# Altium schematic sheet MCU_PART2.SchDoc: WearTech-MCU-P2
size A4; Revision: 1; SheetNumber: 3; SheetTotal: 3; ProjectName: WearTech
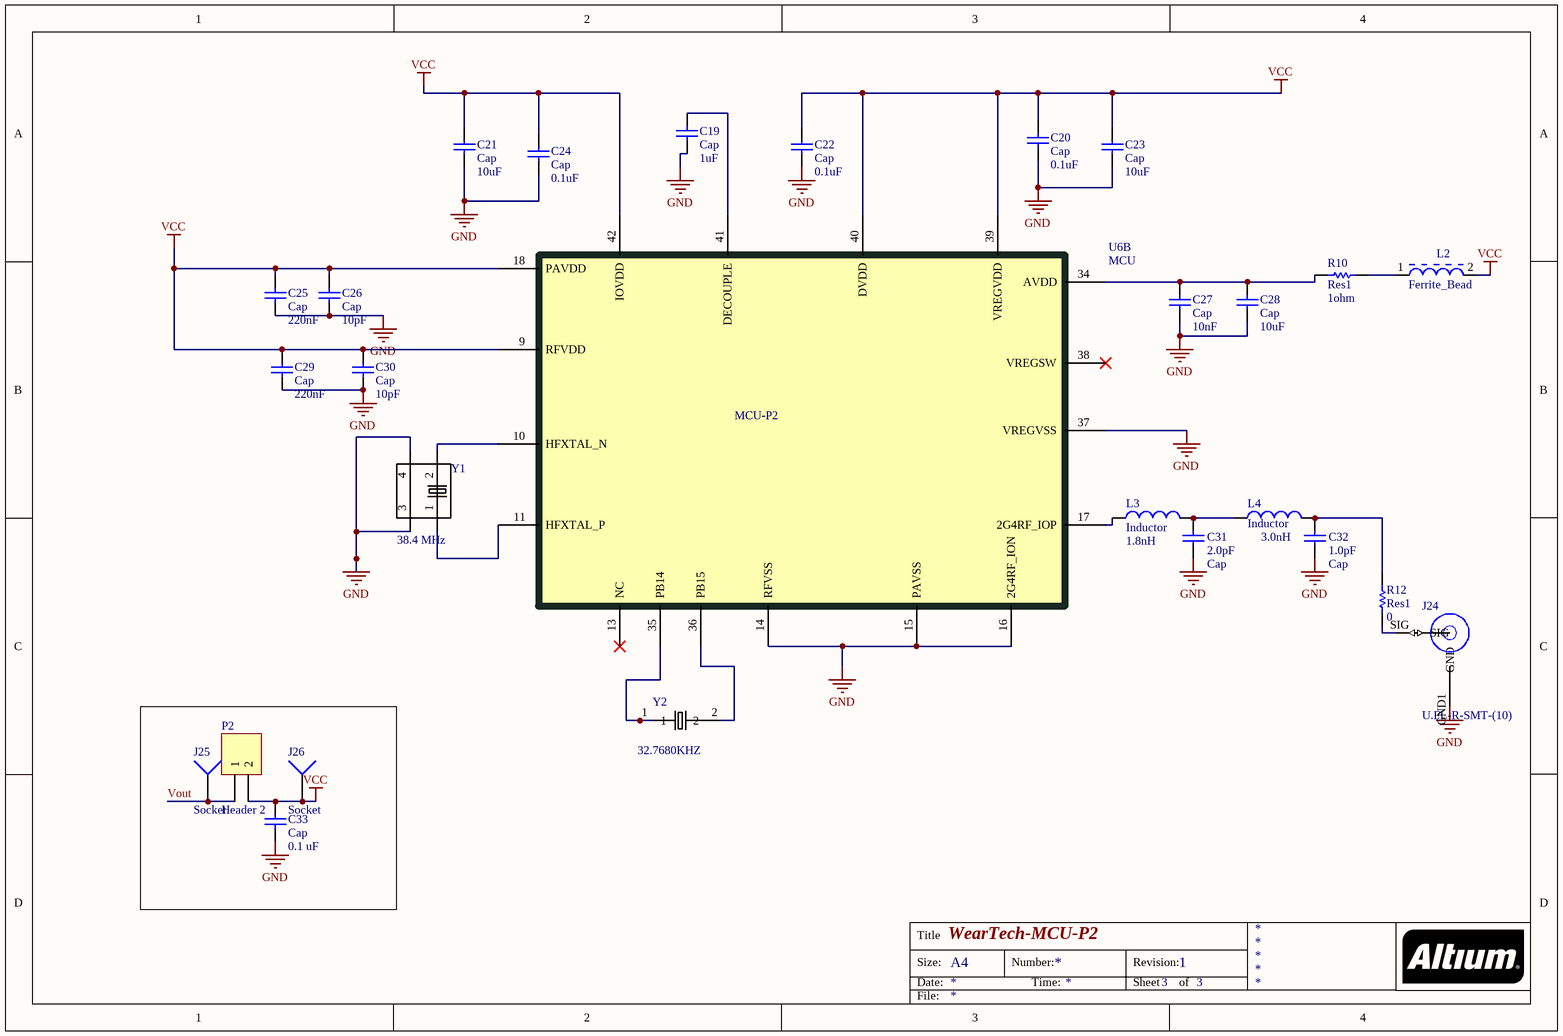
[diagram p0: MCU_PART2.SchDoc]

## Parts
C19  Cap  value 1uF  [1608[0603]]
C20  Cap  value 0.1uF  [1608[0603]]
C21  Cap  value 10uF  [1608[0603]]
C22  Cap  value 0.1uF  [1608[0603]]
C23  Cap  value 10uF  [1608[0603]]
C24  Cap  value 0.1uF  [1608[0603]]
C25  Cap  value 220nF  [1608[0603]]
C26  Cap  value 10pF  [1608[0603]]
C27  Cap  value 10nF  [1608[0603]]
C28  Cap  value 10uF  [1608[0603]]
C29  Cap  value 220nF  [1608[0603]]
C30  Cap  value 10pF  [1608[0603]]
C31  Cap  value 2.0pF  [1608[0603]]
C32  Cap  value 1.0pF  [1608[0603]]
C33  Cap  value 0.1 uF  [1608[0603]]
J24  U.FL-R-SMT-(10)
J25  Socket  [PIN1]
J26  Socket  [PIN1]
L2  Ferrite_Bead
L3  Inductor  value 1.8nH  [1608[0603]]
L4  Inductor  value 3.0nH  [1608[0603]]
P2  Header 2  [HDR1X2]
R10  Res1  value 1ohm  [1608[0603]]
R12  Res1  value 0  [1608[0603]]
U6  MCU  [QFN50P700X700X90_HS-49N]  (part B of 2)
Y1  value 38.4 MHz  (hidden comment: X1)
Y2  value 32.7680KHZ  [X2]  (hidden comment: X2)

## Nets
GND: C19.1 C20.1 C21.1 C22.1 C23.1 C24.1 C25.1 C26.1 C27.1 C28.1 C29.1 C30.1 C31.1 C32.1 C33.1 J24.GND1(GND) U6.14(RFVSS) U6.15(PAVSS) U6.16(2G4RF_ION) U6.37(VREGVSS) Y1.3 Y1.4
VCC: C20.2 C21.2 C22.2 C23.2 C24.2 C25.2 C26.2 C29.2 C30.2 C33.2 J26.1 L2.2 P2.2 U6.9(RFVDD) U6.18(PAVDD) U6.39(VREGVDD) U6.40(DVDD) U6.42(IOVDD)
Vout: J25.1 P2.1
NetC19_2: C19.2 U6.41(DECOUPLE)
NetC27_2: C27.2 C28.2 R10.1 U6.34(AVDD)
NetC31_2: C31.2 L3.2 L4.1
NetC32_2: C32.2 L4.2 R12.2
NetJ24_SIG: J24.SIG R12.1
NetL2_1: L2.1 R10.2
NetL3_1: L3.1 U6.17(2G4RF_IOP)
NetU6_10: U6.10(HFXTAL_N) Y1.2
NetU6_11: U6.11(HFXTAL_P) Y1.1
NetU6_35: U6.35(PB14) Y2.1
NetU6_36: U6.36(PB15) Y2.2

Not connected (* = marked no-connect by the designer): U6 13(NC)* 38(VREGSW)*

## Notes on the sheet
- (near U6) MCU-P2
- Title
- Size:
- Date:
- A4
- Number:
- Time:
- Revision:
- Sheet
- of
- File:

## Library data of the parts
C19 = Cap: CAP CER 1UF 25V X5R 0603; Manufacturer Part-Number: CL10A105KA5LNNC; ComponentLink1URL: http://www.samsungsem.com/kr/support/library/product-catalog/__icsFiles/afieldfile/2017/09/13/MLCC.pdf; Manufacturer: Manufacturer; ComponentLink1Description: Datasheet; Digikey Part Number: 1276-1858-1-ND
C20 C22 C24 C33 = Cap: CAP CER 0.1UF 16V X7R 0603; Manufacturer Part-Number: GRM188R71C104KA01D; Manufacturer: Murata Electronics North America; ComponentLink1URL: http://search.murata.co.jp/Ceramy/image/img/A01X/G101/ENG/GRM188R71C104KA01-01.pdf; ComponentLink1Description: Datasheet; Digikey Part Number: 490-1532-1-ND
C21 C23 C28 = Cap: CAP CER 22UF 4V X5R 0603; Manufacturer Part-Number: CL10A226MR8NQNC; Manufacturer: Samsung Electro-Mechanics; ComponentLink1URL: http://www.samsungsem.com/kr/support/product-search/mlcc/__icsFiles/afieldfile/2016/12/21/CL10A226MR8NQNC_161221_1.pdf; ComponentLink1Description: Datasheet; Digikey Part Number: 1276-1891-1-ND
C25 C29 = Cap: CAP CER 0.22UF 10V X5R 0603; Manufacturer Part-Number: GRM188R61A224KA01D; Manufacturer: Murata Electronics North America; ComponentLink1URL: http://search.murata.co.jp/Ceramy/image/img/A01X/G101/ENG/GRM188R61A224KA01-01.pdf; ComponentLink1Description: Datasheet; Digikey Part Number: 490-1537-1-ND
C26 C30 = Cap: CAP CER 10PF 50V C0G/NP0 0603; Manufacturer Part-Number: GRM1885C1H100JA01D; Manufacturer: Murata Electronics North America; ComponentLink1URL: http://search.murata.co.jp/Ceramy/image/img/A01X/G101/ENG/GRM1885C1H100JA01-01.pdf; ComponentLink1Description: Datasheet; Digikey Part Number: 490-1403-1-ND
C27 = Cap: CAP CER 10000PF 10V U2J 0603; Manufacturer Part-Number: GRM1857U1A103JA44D; Manufacturer: Murata Electronics North America; ComponentLink1URL: http://search.murata.co.jp/Ceramy/image/img/A01X/G101/ENG/GRM1857U1A103JA44-01.pdf; ComponentLink1Description: Datasheet; Digikey Part Number: 490-8269-1-ND
C31 = Cap: CAP CER 2PF 50V C0G/NP0 0603; Manufacturer Part-Number: CL10C020BB8NNNC; Manufacturer: Samsung Electro-Mechanics; ComponentLink1URL: http://www.samsungsem.com/kr/support/product-search/mlcc/__icsFiles/afieldfile/2016/08/18/S_CL10C020BB8NNNC.pdf; ComponentLink1Description: Datasheet; Digikey Part Number: 1276-1815-2-ND
C32 = Cap: CAP CER 1PF 50V C0G/NP0 0603; Manufacturer Part-Number: GRM1885C1H1R0WA01D; Manufacturer: Murata Electronics North America; ComponentLink1URL: http://search.murata.co.jp/Ceramy/image/img/A01X/G101/ENG/GRM1885C1H1R0WA01-01.pdf; ComponentLink1Description: Datasheet; Digikey Part Number: 490-16342-1-ND
J24 = U.FL-R-SMT-(10): CONN UMC RCPT STR 50 OHM SMD; Manufacturer Part-Number: 0734120110; Manufacturer: Molex, LLC; ComponentLink1URL: http://www.molex.com/pdm_docs/ps/PS-73598-021-001.pdf; ComponentLink1Description: Datasheet; Digikey Part Number: WM5587CT-ND
J25 J26 = Socket: Manufacturer Part-Number: 68000-200HLF; Manufacturer: Amphenol FCI; Description: BERGSTRIP .100" DR STRAIGHT; ComponentLink1URL: http://cdn.amphenol-icc.com/media/wysiwyg/files/drawing/68000.pdf; ComponentLink1Description: Datasheet; Digikey Part Number: 609-5099-1-ND
L2 = Ferrite_Bead: FERRITE BEAD 1 KOHM 0603 1LN; Manufacturer Part-Number: 74279266; Manufacturer: Wurth Electronics Inc.; ComponentLink1URL: http://katalog.we-online.de/pbs/datasheet/74279266.pdf; ComponentLink1Description: Datasheet; Digikey Part Number: 732-4484-1-ND
L3 = Inductor: FIXED IND 1.8NH 250MA 400 MOHM; Manufacturer Part-Number: LQP18MN1N8C02D; Manufacturer: Murata Electronics North America; ComponentLink1URL: http://search.murata.co.jp/Ceramy/image/img/P02/JELF243C-0009.pdf; ComponentLink1Description: Datasheet; Digikey Part Number: 490-11750-1-ND
L4 = Inductor: FIXED IND 3NH 670MA 170 MOHM SMD; Manufacturer Part-Number: LQW18AN3N0C80D; Manufacturer: Murata Electronics North America; ComponentLink1URL: http://search.murata.co.jp/Ceramy/image/img/P02/JELF243A-0102.pdf; ComponentLink1Description: Datasheet; Digikey Part Number: 490-11771-1-ND
P2 = Header 2: Header, 2-Pin; Manufacturer Part-Number: SPC02SYAN; Manufacturer: Sullins Connector Solutions; Description: CONN JUMPER SHORTING GOLD FLASH; ComponentLink1URL: http://www.sullinscorp.com/catalogs/282_PAGE124-125_.100_JUMPER.pdf; ComponentLink1Description: Datasheet; Digikey Part Number: S9001-ND
R10 = Res1: RES SMD 1 OHM 1% 1/10W 0603; Manufacturer Part-Number: RC0603FR-071RL; Manufacturer: Yageo; ComponentLink1URL: http://www.yageo.com/documents/recent/PYu-RC_Group_51_RoHS_L_8.pdf; ComponentLink1Description: Datasheet; Digikey Part Number: 311-1.00HRCT-ND
R12 = Res1: RES SMD 0 OHM JUMPER 1/10W 0603; Manufacturer Part-Number: RC0603JR-070RL; Manufacturer: Yageo; ComponentLink1URL: http://www.yageo.com/documents/recent/PYu-RC_Group_51_RoHS_L_8.pdf; ComponentLink1Description: Datasheet; Digikey Part Number: 311-0.0GRCT-ND
U6 = MCU: RF System on a Chip - SoC Blue Premium 19dBm 2.4G 512kB 64kB(RAM); Manufacturer Part-Number: EFR32BG13P732F512GM48-C; Manufacturer: Silicon Labs; ComponentLink1URL: http://www.mouser.com/ds/2/368/efr32bg13-datasheet-1114948.pdf; ComponentLink1Description: Datasheet; Mouser Part Number: 634-EFR32BG13P732-C
Y1 = X1: Manufacturer Part-Number: CT1612DB38400C0FLHA1; Manufacturer: AVX Corp/Kyocera Corp; Description: CRYSTAL 38.4000MHZ 7PF SMD; ComponentLink1URL: https://media.digikey.com/pdf/Data%20Sheets/AVX%20PDFs/CT1612DB38400C0FLHA1_Spec~.pdf; ComponentLink1Description: Datasheet; Digikey Part Number: 1253-1777-1-ND
Y2 = X2: CRYSTAL 32.7680KHZ 12.5PF SMD; Manufacturer Part-Number: 9HT10-32.768KDZF-T; Manufacturer: TXC CORPORATION; ComponentLink1URL: http://www.txccorp.com/download/products/quartz_crystals/2015TXC_9HT10_31.pdf; ComponentLink1Description: Datasheet; Digikey Part Number: 887-1504-1-ND